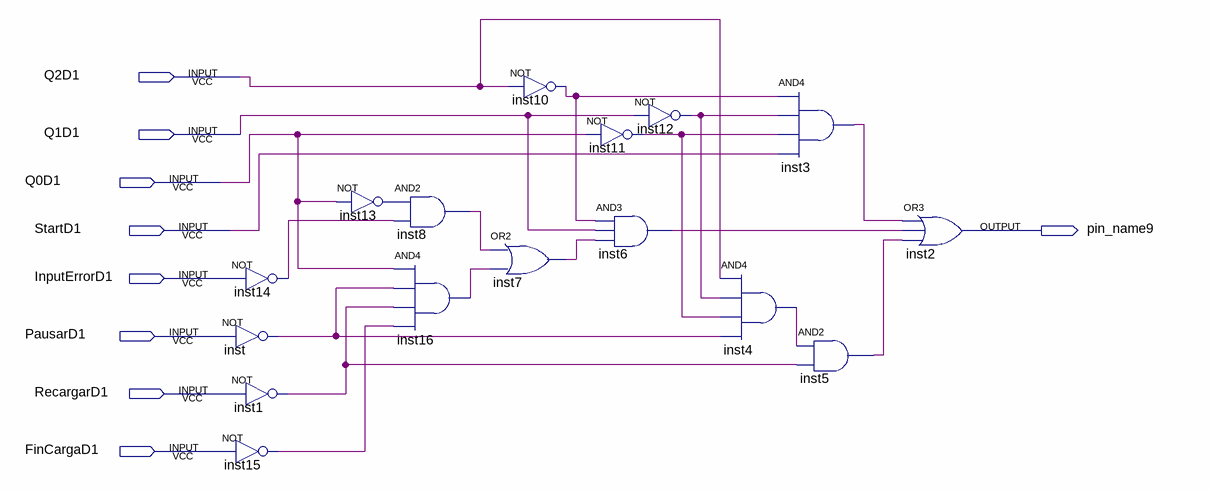
[diagram p0: schematic sheet]
// Quartus schematic ControllerD1.bdf as structural Verilog: 16 symbols, 9 pins
module ControllerD1 (
  input  Q2D1,
  input  Q1D1,
  input  Q0D1,
  input  StartD1,
  input  InputErrorD1,
  input  PausarD1,
  input  RecargarD1,
  input  FinCargaD1,
  output pin_name9
);

  wire inst1_out, inst3_out, inst4_out, inst5_out, inst6_out, inst7_out, inst8_out, inst10_out, inst11_out,
       inst12_out, inst13_out, inst14_out, inst15_out, inst16_out, inst_out;

  not inst14 (inst14_out, InputErrorD1);
  not inst (inst_out, PausarD1);
  not inst1 (inst1_out, RecargarD1);
  not inst15 (inst15_out, FinCargaD1);
  not inst13 (inst13_out, Q0D1);
  and inst8 (inst8_out, inst13_out, inst14_out);
  and inst16 (inst16_out, Q0D1, inst_out, inst1_out, inst15_out);
  not inst10 (inst10_out, Q2D1);
  or inst7 (inst7_out, inst8_out, inst16_out);
  not inst11 (inst11_out, Q0D1);
  not inst12 (inst12_out, Q1D1);
  and inst6 (inst6_out, inst10_out, Q1D1, inst7_out);
  and inst4 (inst4_out, Q2D1, inst12_out, inst11_out, inst_out);
  and inst3 (inst3_out, inst10_out, inst12_out, inst11_out, StartD1);
  and inst5 (inst5_out, inst4_out, inst1_out);
  or inst2 (pin_name9, inst3_out, inst6_out, inst5_out);
endmodule
